# Altium schematic sheet A3_1_G.SchDoc
size 421 x 297 mm; Organization: Наименование организации; SheetNumber: №; SheetTotal: №№; ESKD_Proveril: Лозин; ESKD_DIVG: ДИВГ.хххххх.ххх Э3; ESKD_Razrabotal: Вихров; ESKD_utverdil: Кобак; ESKD_Soglasovano: Соглас.; ESKD_DIVG_SP: ДИВГ.хххххх.ххх; ESKD_NK_FIO: Шкатырев
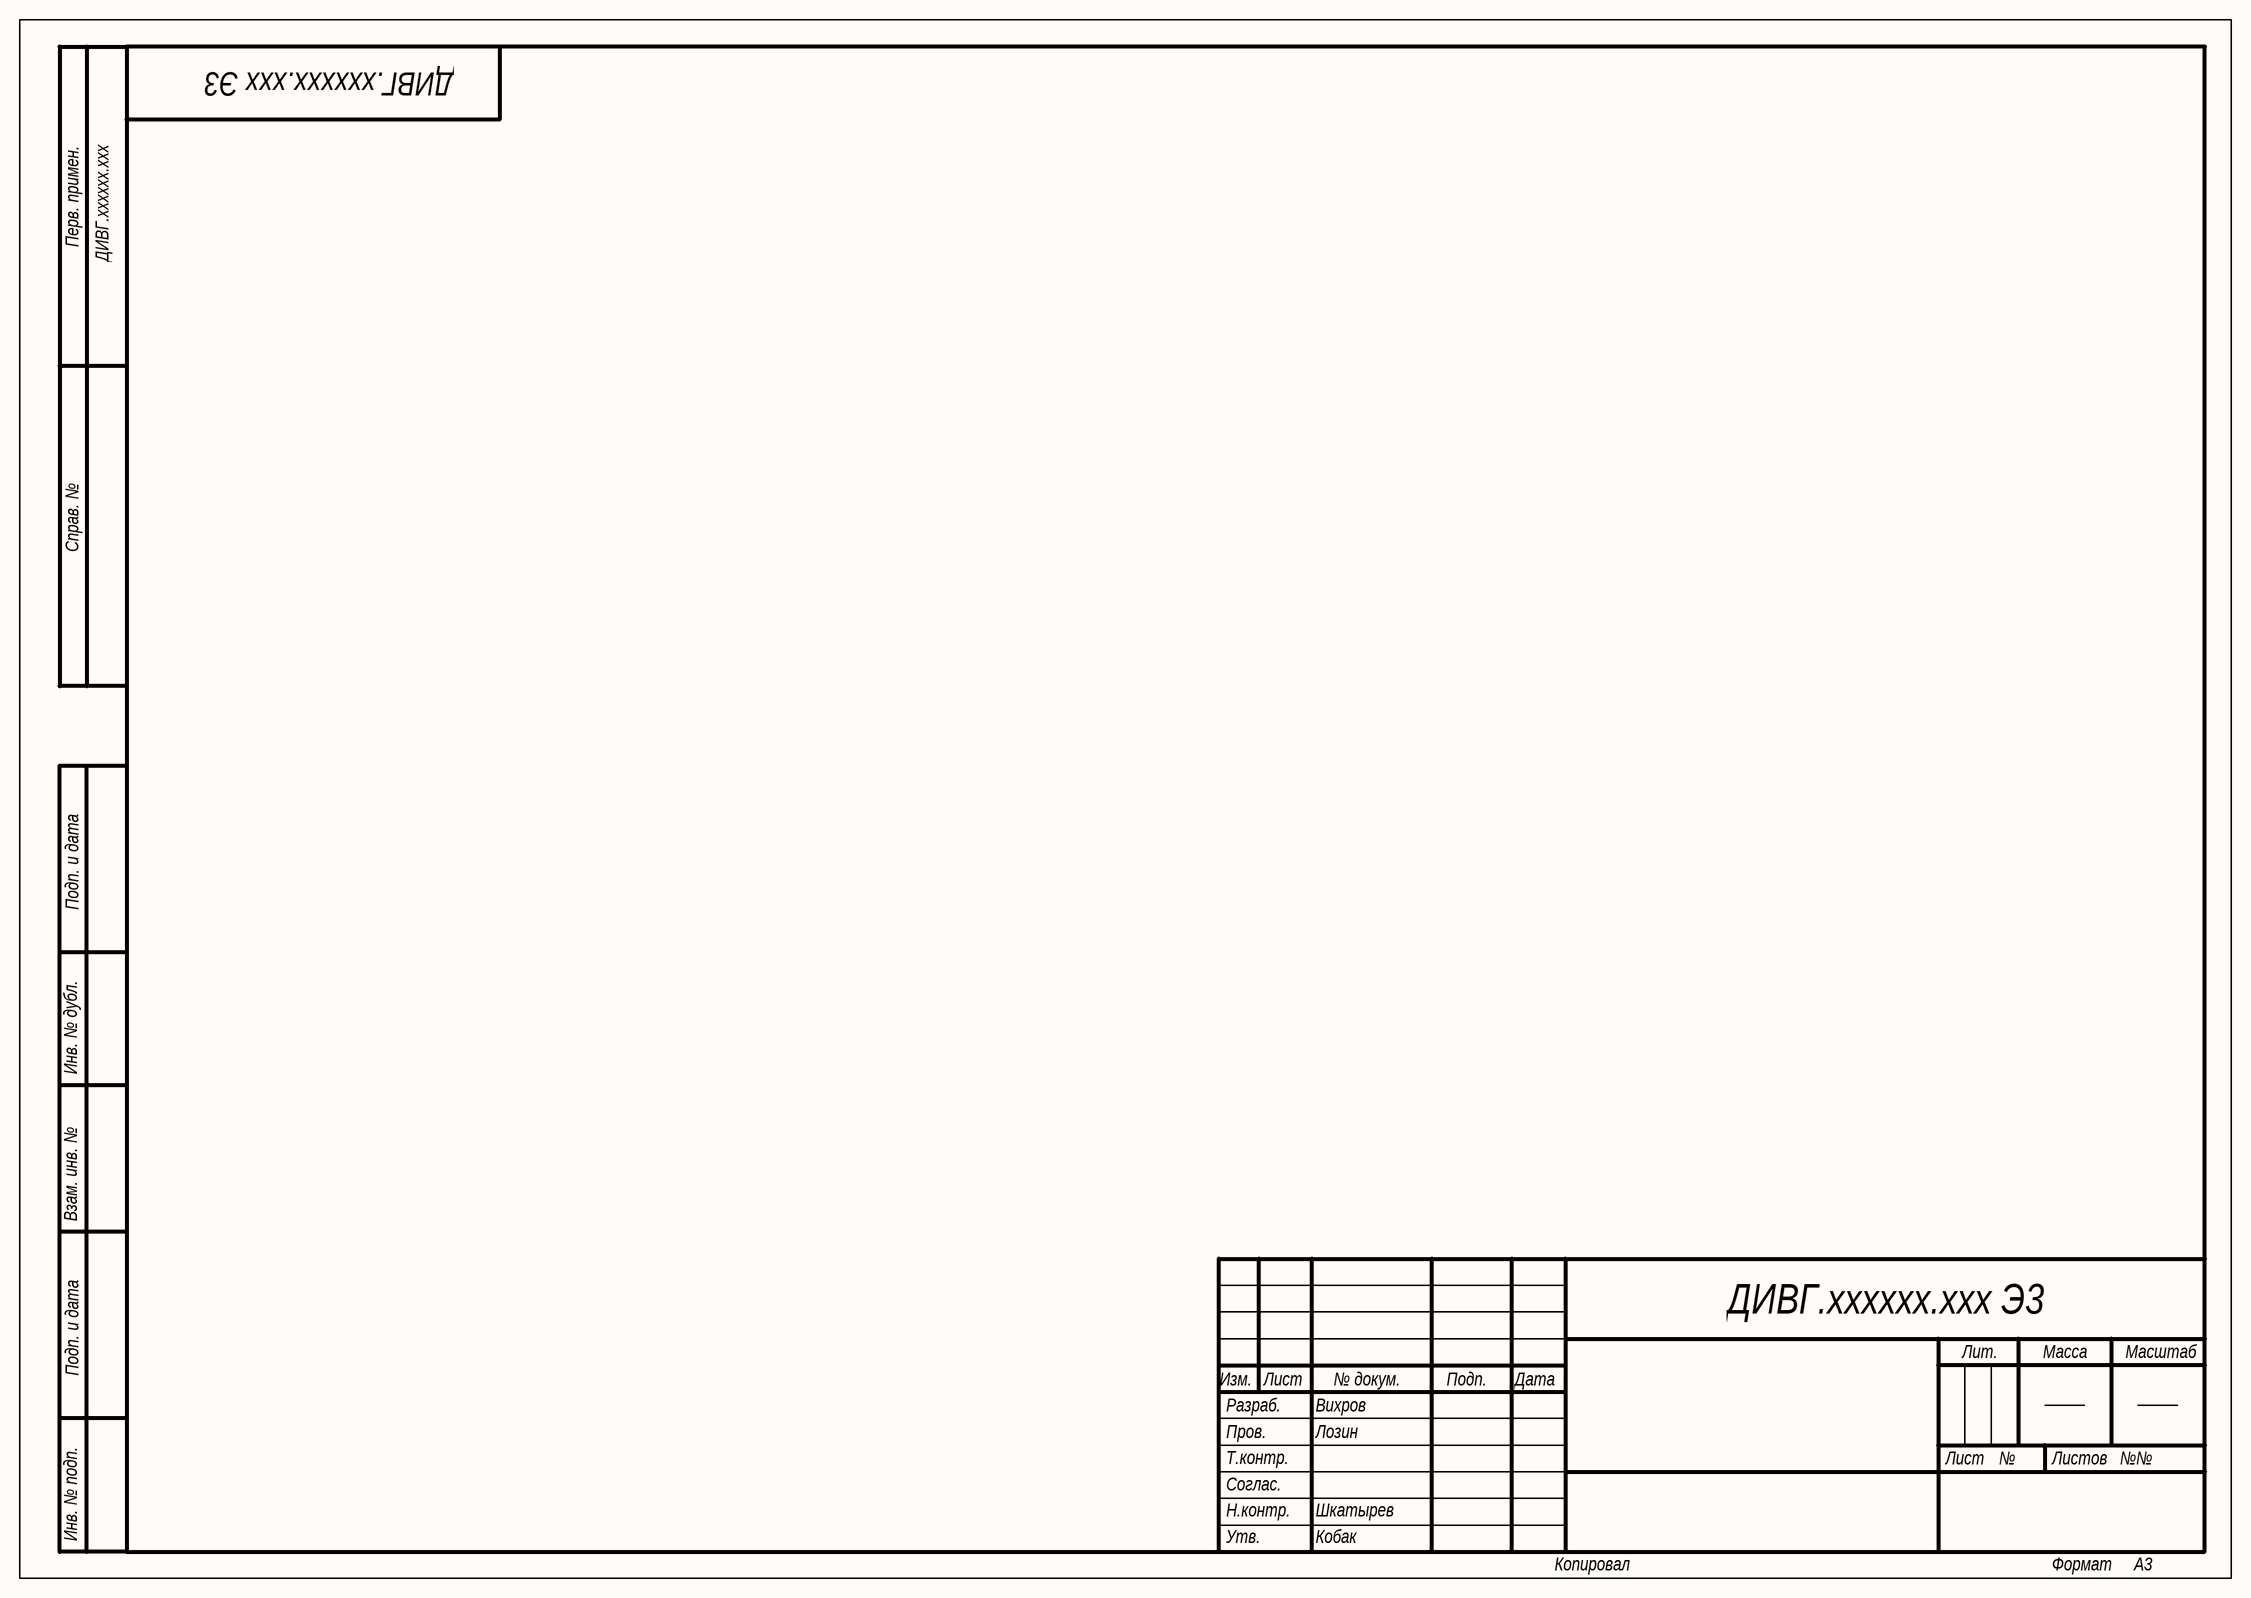
[diagram p0: A3_1_G.SchDoc]

## Notes on the sheet
- Перв. примен.
- Справ. №
- Подп. и дата
- Инв. № дубл.
- Взам. инв. №
- Разраб.
- Изм.
- Лист
- № докум.
- Подп.
- Дата
- Лит.
- Масса
- Масштаб
- Пров.
- Т.контр.
- Листов
- Инв. № подп.
- Н.контр.
- Утв.
- Копировал
- Формат     А3